# Altium schematic sheet RoBeast_Power_Linear.SchDoc: Power (Linear Regulator)
size A; ApprovedBy: CR; DrawnBy: VM & IG; Revision: V1; SheetNumber: 6; SheetTotal: 9
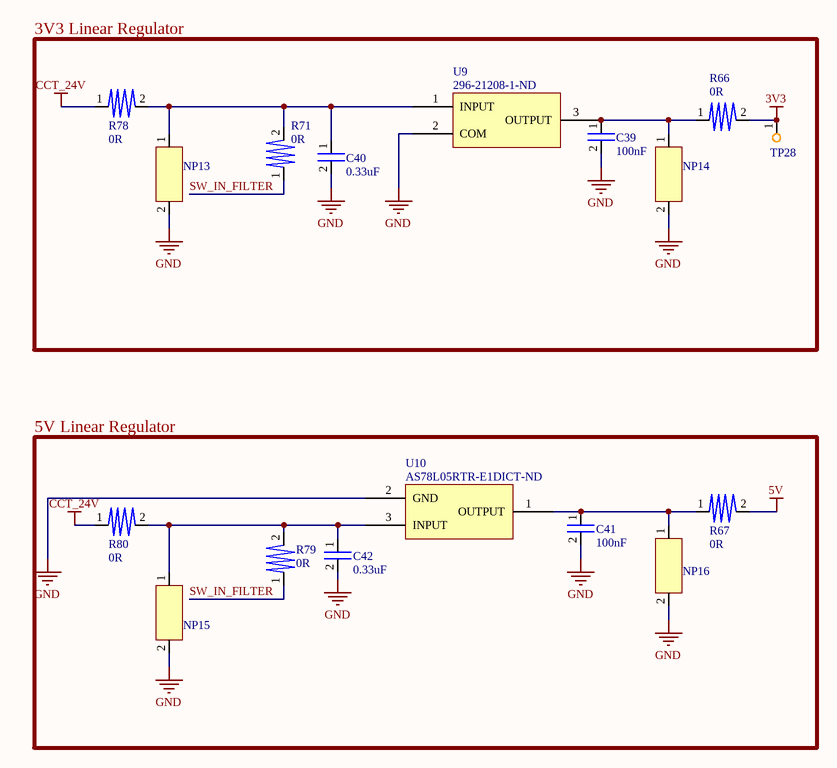
[diagram p0: RoBeast_Power_Linear.SchDoc]

## Parts
C39  100nF  [0805]
C40  0.33uF  [0805]
C41  100nF  [0805]
C42  0.33uF  [0805]
NP13  Not Populated  [0805]  (value not drawn)
NP14  Not Populated  [0805]  (value not drawn)
NP15  Not Populated  [0805]  (value not drawn)
NP16  Not Populated  [0805]  (value not drawn)
R66  0R  [0805]
R67  0R  [0805]
R71  0R  [0805]
R78  0R  [0805]
R79  0R  [0805]
R80  0R  [0805]
TP28  Test Point  [Test Point]  (value not drawn)
U9  Supplier Part Number 1: 296-21208-1-ND  [UA78M33CKVURG3]  (hidden comment: Fixed 3V3 Voltage Regulator)
U10  Supplier Part Number 1: AS78L05RTR-E1DICT-ND  [AS78L05RTR-E1]  (hidden comment: Fixed 5V Linear Regulator)

## Blocks framed on the sheet
3V3 Linear Regulator: C39 C40 NP13 NP14 R66 R71 R78 TP28 U9
5V Linear Regulator: C41 C42 NP15 NP16 R67 R79 R80 U10

## Nets
3V3: R66.2 TP28.1
5V: R67.2
CCT_24V: R78.1 R80.1
GND: C39.2 C40.2 C41.2 C42.2 NP13.2 NP14.2 NP15.2 NP16.2 U9.2(COM) U10.2(GND)
SW_IN_FILTER: R71.1 R79.1
NetC39_1: C39.1 NP14.1 R66.1 U9.3(OUTPUT)
NetC40_1: C40.1 NP13.1 R71.2 R78.2 U9.1(INPUT)
NetC41_1: C41.1 NP16.1 R67.1 U10.1(OUTPUT)
NetC42_1: C42.1 NP15.1 R79.2 R80.2 U10.3(INPUT)

## Library data of the parts
C39 C41 = C0805C104J5RAC7800: Ceramic Capacitor, Multilayer, Ceramic, 50V, 5% +Tol, 5% -Tol, X7R, 15% TC, 0.1uF, Surface Mount, 0805; Manufacturer: KEMET; Manufacturer Part Number: C0805C104J5RACTU; Multilayer: Yes; Supplier 1: Digikey; RoHS: Yes; Category: Ceramic Capacitors; Stock 1: 605061; Pricing 1: 1=0.18, 10=0.122, 50=0.0732, 100=0.0576, 500=0.04252, 1000=0.03519 (USD); Mount: Surface Mount; Number of Pins: 2; Dielectric Material: Ceramic; Package Shape: Rectangular; Size Code: 0805; Terminal Finish: Nickel; Min Operating Temperature: -55°C; Max Operating Temperature: 125°C; JESD-609 Code: e3; Capacitor Type: Ceramic; Negative Tolerance: 5%; Packaging: Tape and Reel; Positive Tolerance: 5%; Rated DC Voltage (URdc): 50V; Temperature Characteristics Code: X7R; Termination: Wraparound; Reach SVHC Compliant: Yes; RoHS Compliant: Yes; ComponentLink1URL: http://capacitoredge.kemet.com:80/capedge2/intellispec.jsp?pn=C0805C104J5RACTU&displayPN=C0805C104J5RACTU&src-supplier=IHS+Markit; ComponentLink1Description: http://capacitoredge.kemet.com:80/capedge2/intellispec.jsp?pn=C0805C104J5RACTU&displayPN=C0805C104J5RACTU&src-supplier=IHS+Markit; ComponentLink2URL: https://datasheet.ciiva.com/7842/1732721-7842179.pdf?src-supplier=Element14; ComponentLink2Description: https://datasheet.ciiva.com/7842/1732721-7842179.pdf?src-supplier=Element14; ComponentLink3URL: https://datasheet.ciiva.com/28682/1851736-28682223.pdf?src-supplier=Element14; ComponentLink3Description: https://datasheet.ciiva.com/28682/1851736-28682223.pdf?src-supplier=Element14; ComponentLink4URL: https://datasheet.ciiva.com/7258/1828800-7258413.pdf?src-supplier=Newark; ComponentLink4Description: https://datasheet.ciiva.com/7258/1828800-7258413.pdf?src-supplier=Newark; ComponentLink5URL: https://datasheet.ciiva.com/14589/70095383-14589015.pdf?src-supplier=Allied+Electronics; ComponentLink5Description: https://datasheet.ciiva.com/14589/70095383-14589015.pdf?src-supplier=Allied+Electronics; ComponentLink6URL: https://datasheet.ciiva.com/5417/kem-c1002-x7r-smd-5417352.pdf?src-supplier=Mouser; ComponentLink6Description: https://datasheet.ciiva.com/5417/kem-c1002-x7r-smd-5417352.pdf?src-supplier=Mouser; ComponentLink7URL: https://datasheet.ciiva.com/39122/docfinderpartnumberc0402c102k5ractu-39122924.pdf?src-supplier=Onlinecomponents.com; ComponentLink7Description: https://datasheet.ciiva.com/39122/docfinderpartnumberc0402c102k5ractu-39122924.pdf?src-supplier=Onlinecomponents.com; Supplier Part Number 1: 399-C0805C104J5RAC7800CT-ND; Capacitance: 100nF
C40 C42 = C0805C334K5RAC7800: Ceramic Capacitor, Multilayer, Ceramic, 50V, 10% +Tol, 10% -Tol, X7R, 15% TC, 0.33uF, Surface Mount, 0805; Manufacturer: KEMET; Manufacturer Part Number: C0805C334K5RACTU; Capacitance: 330nF; Multilayer: Yes; Supplier 1: Digikey; RoHS: Yes; Category: Ceramic Capacitors; Stock 1: 50949; Pricing 1: 1=0.16, 10=0.111, 50=0.0662, 100=0.0521, 500=0.0385, 1000=0.03188 (USD); Mount: Surface Mount; Number of Pins: 2; Dielectric Material: Ceramic; Package Shape: Rectangular; Size Code: 0805; Terminal Finish: Nickel; Min Operating Temperature: -55°C; Max Operating Temperature: 125°C; JESD-609 Code: e3; Capacitor Type: Ceramic; Negative Tolerance: 10%; Packaging: Tape and Reel; Positive Tolerance: 10%; Rated DC Voltage (URdc): 50V; Temperature Characteristics Code: X7R; Termination: Wraparound; Manufacturer Series: C0805C334K5RACTU; Reach SVHC Compliant: Yes; RoHS Compliant: Yes; ComponentLink1URL: http://capacitoredge.kemet.com:80/capedge2/DataSheet/Datasheet-C0805C334K5RAC7800.pdf?pn=C0805C334K5RAC7800&src-supplier=IHS+Markit; ComponentLink1Description: http://capacitoredge.kemet.com:80/capedge2/DataSheet/Datasheet-C0805C334K5RAC7800.pdf?pn=C0805C334K5RAC7800&src-supplier=IHS+Markit; ComponentLink2URL: https://datasheet.ciiva.com/28608/1851736-28608437.pdf?src-supplier=Element14; ComponentLink2Description: https://datasheet.ciiva.com/28608/1851736-28608437.pdf?src-supplier=Element14; ComponentLink3URL: https://datasheet.ciiva.com/28696/1851736-28696038.pdf?src-supplier=Element14; ComponentLink3Description: https://datasheet.ciiva.com/28696/1851736-28696038.pdf?src-supplier=Element14; ComponentLink4URL: https://datasheet.ciiva.com/18193/getdatasheetpartid-385729-18193783.pdf?src-supplier=Verical; ComponentLink4Description: https://datasheet.ciiva.com/18193/getdatasheetpartid-385729-18193783.pdf?src-supplier=Verical; ComponentLink5URL: https://datasheet.ciiva.com/18193/getdatasheetpartid-93202-18193786.pdf?src-supplier=Verical; ComponentLink5Description: https://datasheet.ciiva.com/18193/getdatasheetpartid-93202-18193786.pdf?src-supplier=Verical; Supplier Part Number 1: 399-C0805C334K5RAC7800CT-ND
NP13-NP16 = NP
R66 R67 R71 R78-R80 = RMCF0805ZT0R00: Fixed Resistor, Metal Glaze/thick Film, 0.125W, 0ohm, Surface Mount, 0805; Manufacturer: Stackpole Electronics; Rated Power Dissipation (P): 125mW; Rated Temperature: 70°C; Working Voltage: 150V; Package Height: 0.5mm; Package Length: 2mm; Package Width: 1.25mm; Reference Standard: AEC-Q200; Supplier 1: Digikey; Manufacturer Part Number: RMCF0805ZT0R00; RoHS: Yes; Category: Chip SMD Resistors; Stock 1: 1154169; Pricing 1: 1=0.1, 10=0.017, 25=0.0128, 50=0.0096, 100=0.0068, 250=0.00544, 500=0.00436, 1000=0.00321 (USD); Mount: Surface Mount; Number of Pins: 2; Package Shape: Rectangular; Size Code: 0805; Terminal Finish: Nickel; Min Operating Temperature: -55°C; Max Operating Temperature: 155°C; JESD-609 Code: e3; Resistor Type: FIXED RESISTOR; Construction: Rectangular; Package Style: SMTMeter; Packaging: Tape and Reel; Resistance: 0R; Technology: METAL GLAZE/THICK FILM; Termination: Wraparound; Reach SVHC Compliant: Yes; RoHS Compliant: Yes; ComponentLink1URL: https://datasheet.ciiva.com:443/pdfs/VipMasterIC/IC/SEIE/SEIE-S-A0007077258/SEIE-S-A0007077258-1.pdf?src-supplier=IHS+Markit; ComponentLink1Description: https://datasheet.ciiva.com:443/pdfs/VipMasterIC/IC/SEIE/SEIE-S-A0007077258/SEIE-S-A0007077258-1.pdf?src-supplier=IHS+Markit; ComponentLink2URL: https://datasheet.ciiva.com/15193/getdatasheetpartid-360417-15193658.pdf?src-supplier=Verical; ComponentLink2Description: https://datasheet.ciiva.com/15193/getdatasheetpartid-360417-15193658.pdf?src-supplier=Verical; Supplier Part Number 1: RMCF0805ZT0R00CT-ND
U9 = UA78M33CKVURG3: Fixed Positive Standard Regulator, 3.3VBIPolar, PSSO2; Manufacturer: Texas Instruments; Package Body Material: Plastic; Dropout Voltage1-Nom: 2V; Input Voltage Absolute-Max: 35V; Max Input Voltage: 25V; Min Input Voltage: 5.3V; Line Regulation-Max: 0.1%; Number of Functions: 1; Output Current1-Max: 500mA; Output Voltage1-Max: 3.5V; Output Voltage1-Min: 3.1V; Output Voltage1-Nom: 3.3V; Package Equivalence Code: SMSIP3H,.38,90TB; Regulator Type: FIXED POSITIVE SINGLE OUTPUT STANDARD REGULATOR; Voltage Tolerance-Max: 6%; Qualification Status: Not Qualified; Supplier 1: Digikey; Manufacturer Part Number: UA78M33CKVURG3; RoHS: Yes; Category: Voltage Regulators - Linear; Stock 1: 58004; Pricing 1: 1=0.59, 10=0.517, 25=0.4852, 100=0.3961, 250=0.36792, 500=0.31312, 1000=0.2505 (USD); Package Code: TO-252; Number of Pins: 2; Package Shape: Rectangular; Terminal Finish: Tin; JESD-609 Code: e3; Adjustability: FIXED; JESD-30 Code: R-PSSO-G2; Load Regulation-Max: 0.1%; Moisture Sensitivity Level: 3; Number of Outputs: 1; Operating Temperature, TJ-Max: 125°C; Operating Temperature, TJ-Min: 0°C; Package Style: SMALL OUTLINE, HEAT SINK/SLUGMeter; Packaging: Tape and Reel; Peak Reflow Temperature (Cel): 260°C; Surface Mount: Yes; Technology: BIPOLAR; Terminal Form: Gull Wing; Terminal Position: SINGLE; Length: 6.6mm; Width: 6.095mm; Height - Seated (Max): 2.52mm; Terminal Pitch: 2.29mm; Reach SVHC Compliant: Yes; RoHS Compliant: Yes; ComponentLink1URL: https://www.ti.com:443/lit/ds/symlink/ua78m.pdf?src-supplier=IHS+Markit; ComponentLink1Description: https://www.ti.com:443/lit/ds/symlink/ua78m.pdf?src-supplier=IHS+Markit; ComponentLink2URL: https://datasheet.ciiva.com/1512/1882046-1512317.pdf?src-supplier=Element14; ComponentLink2Description: https://datasheet.ciiva.com/1512/1882046-1512317.pdf?src-supplier=Element14; ComponentLink3URL: https://datasheet.ciiva.com/46394/1882046-46394975.pdf?src-supplier=Element14; ComponentLink3Description: https://datasheet.ciiva.com/46394/1882046-46394975.pdf?src-supplier=Element14; ComponentLink4URL: https://datasheet.ciiva.com/2042/ua78m05-2042378.pdf?src-supplier=Digikey; ComponentLink4Description: https://datasheet.ciiva.com/2042/ua78m05-2042378.pdf?src-supplier=Digikey; ComponentLink5URL: https://datasheet.ciiva.com/2042/ua78m05-2042377.pdf?src-supplier=Digikey; ComponentLink5Description: https://datasheet.ciiva.com/2042/ua78m05-2042377.pdf?src-supplier=Digikey; ComponentLink6URL: https://datasheet.ciiva.com/2042/ua78m05-2042376.pdf?src-supplier=Digikey; ComponentLink6Description: https://datasheet.ciiva.com/2042/ua78m05-2042376.pdf?src-supplier=Digikey
U10 = AS78L05RTR-E1: Fixed Positive Standard Regulator, 5VBIPolar; Manufacturer: Diodes; Package Body Material: Plastic; Dropout Voltage1-Nom: 1.8V; Input Voltage Absolute-Max: 36V; Line Regulation-Max: 0.15%; Load Regulation-Max: 0.06%; Number of Outputs: 1; Output Current1-Max: 100mA; Package Equivalence Code: TO-243; Regulator Type: FIXED POSITIVE SINGLE OUTPUT STANDARD REGULATOR; Voltage Tolerance-Max: 5%; Qualification Status: Not Qualified; Supplier 1: Digikey; Manufacturer Part Number: AS78L05RTR-E1; RoHS: Yes; Category: Voltage Regulators - Linear; Stock 1: 132070; Pricing 1: 1=0.39, 10=0.291, 25=0.2628, 100=0.1815, 250=0.15288, 500=0.1242 (USD); Number of Pins: 3; Terminal Finish: Tin; JESD-609 Code: e3; Adjustability: FIXED; Moisture Sensitivity Level: 3; Operating Temperature, TJ-Max: 125°C; Operating Temperature, TJ-Min: -40°C; Output Voltage1-Nom: 5V; Packaging: Tape and Reel; Surface Mount: Yes; Technology: BIPOLAR; Reach SVHC Compliant: Yes; RoHS Compliant: Yes; ComponentLink1URL: https://datasheet.ciiva.com:443/pdfs/VipMasterIC/IC/DIOD/DIODS20236/DIODS20236-1.pdf?src-supplier=IHS+Markit; ComponentLink1Description: https://datasheet.ciiva.com:443/pdfs/VipMasterIC/IC/DIOD/DIODS20236/DIODS20236-1.pdf?src-supplier=IHS+Markit; ComponentLink2URL: https://datasheet.ciiva.com/30016/as78lxx-30016635.pdf?src-supplier=Avnet; ComponentLink2Description: https://datasheet.ciiva.com/30016/as78lxx-30016635.pdf?src-supplier=Avnet